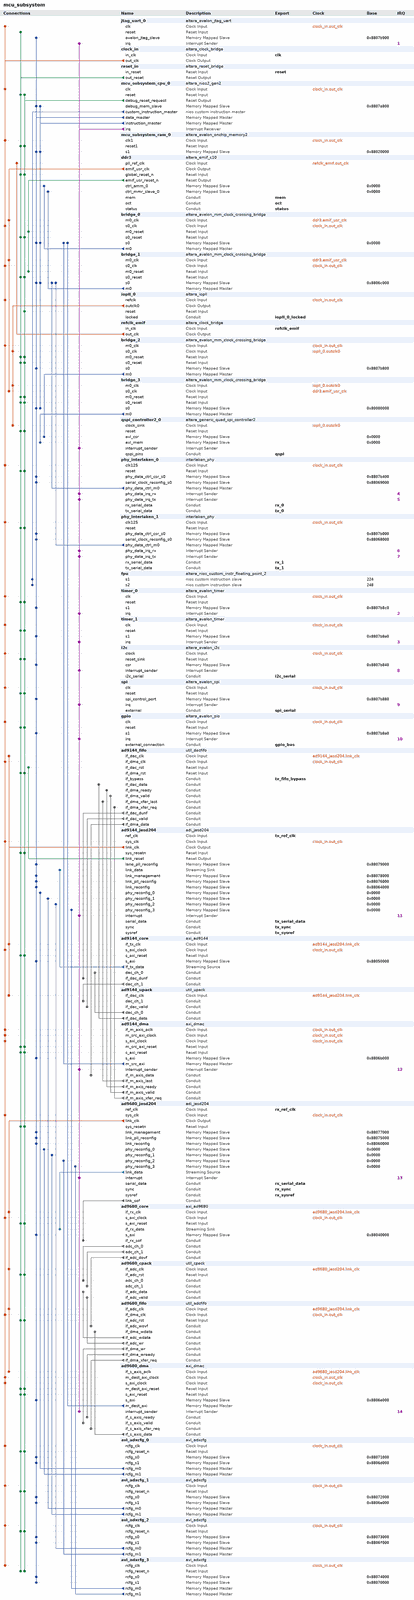
[diagram p0: system contents, whole]
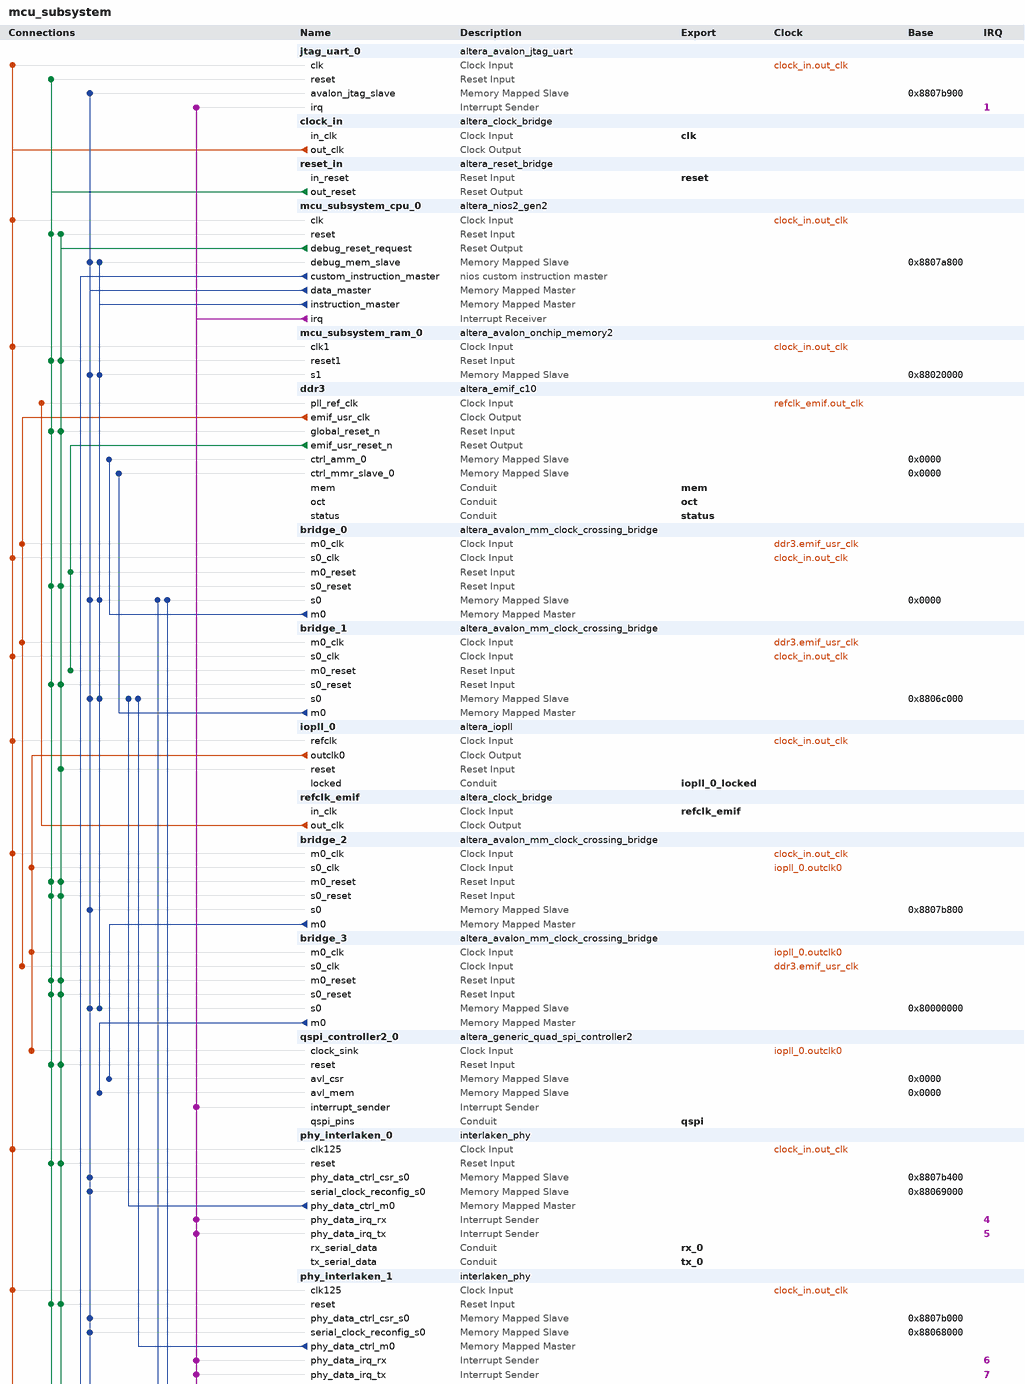
[diagram p1: system contents, upper part]
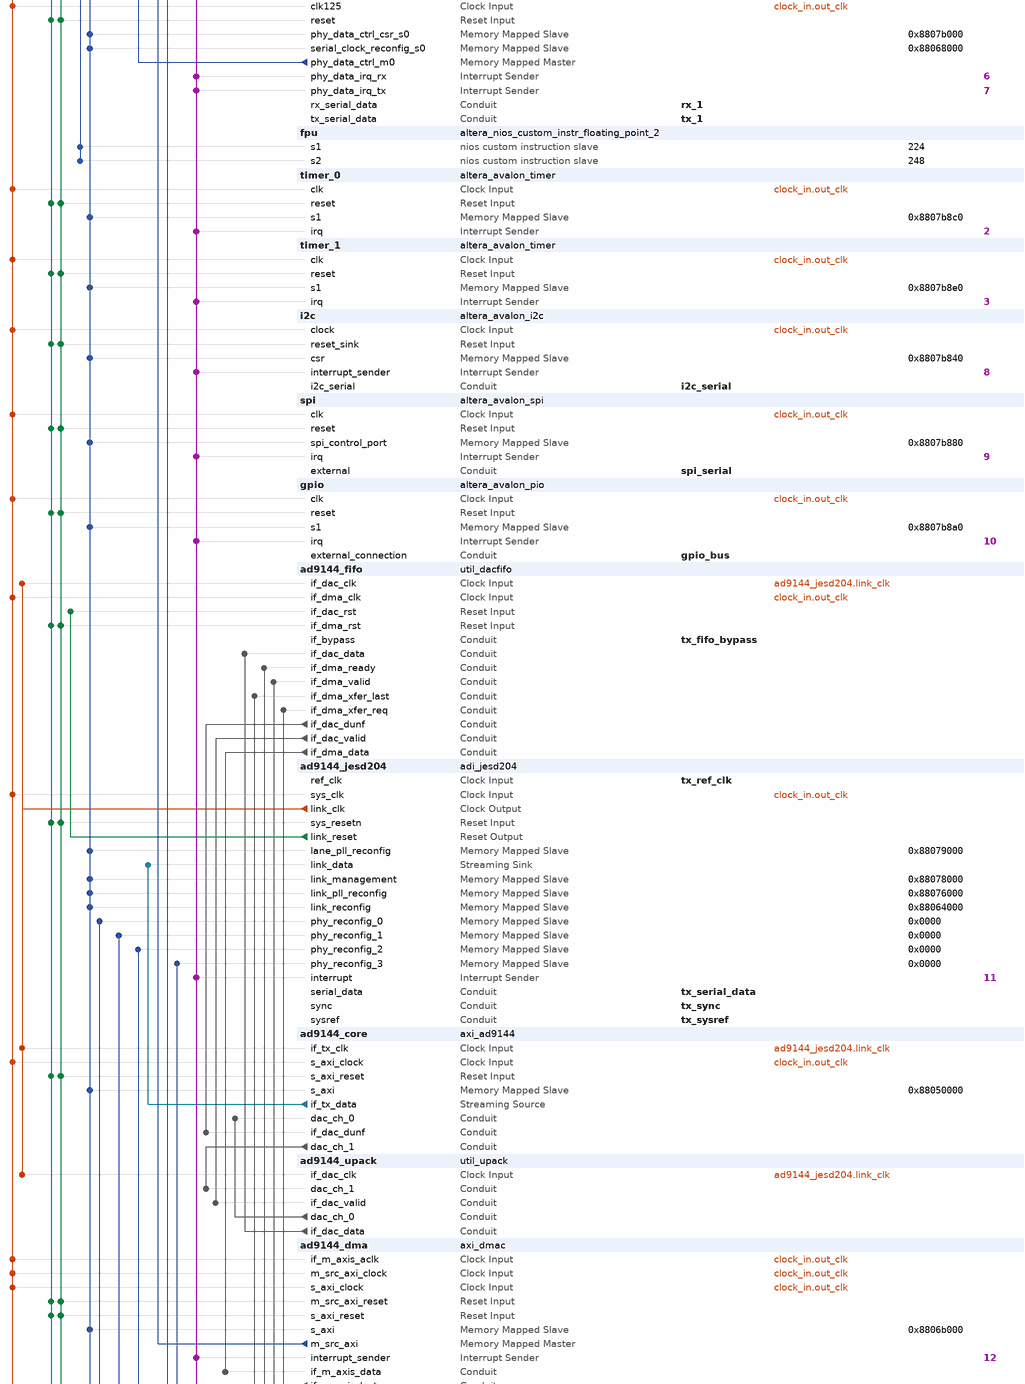
[diagram p2: system contents, middle part]
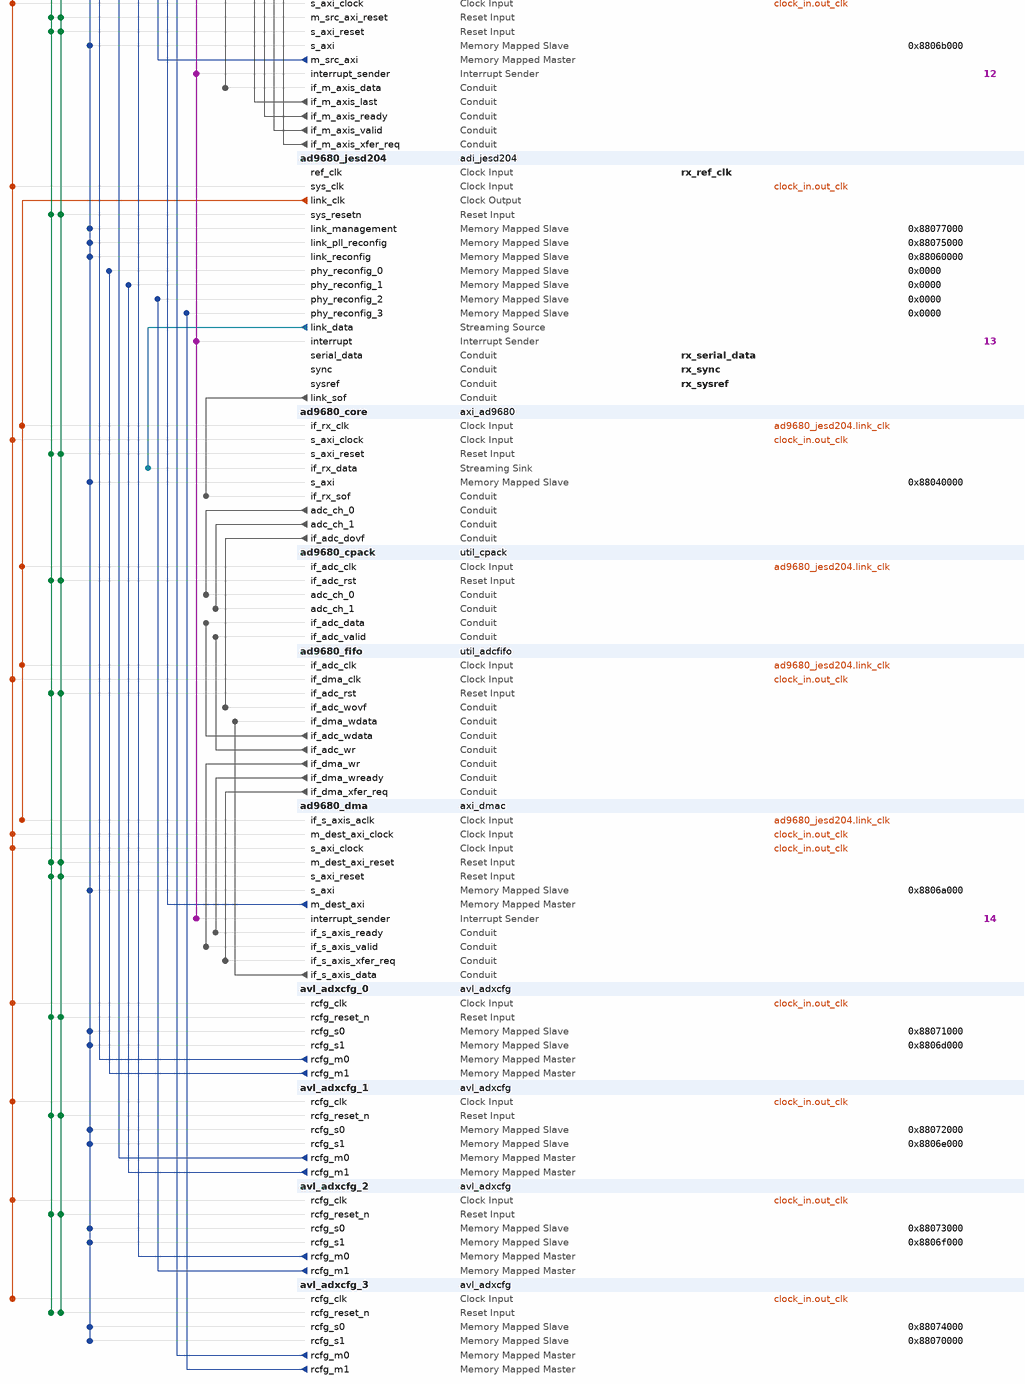
[diagram p3: system contents, lower part]
# Platform Designer (Qsys) system mcu_subsystem, Cyclone 10 GX 10CX220YF780I5G
# Parameters at their usual value, and those the tool derives, are not listed.
package require -exact qsys 1.0
create_system mcu_subsystem
set_project_property DEVICE_FAMILY {Cyclone 10 GX}
set_project_property DEVICE 10CX220YF780I5G

add_component jtag_uart_0 ip/mcu_subsystem/mcu_subsystem_jtag_uart_0.ip altera_avalon_jtag_uart jtag_uart_0 18.1

add_component clock_in ip/mcu_subsystem/mcu_subsystem_clock_in.ip altera_clock_bridge clock_in 18.1
load_component clock_in
set_component_parameter_value DERIVED_CLOCK_RATE 0
set_component_parameter_value EXPLICIT_CLOCK_RATE 125000000
save_component

add_component reset_in ip/mcu_subsystem/mcu_subsystem_reset_in.ip altera_reset_bridge reset_in 18.1
load_component reset_in
set_component_parameter_value ACTIVE_LOW_RESET 1
set_component_parameter_value SYNCHRONOUS_EDGES none
set_component_parameter_value SYNC_RESET 0
save_component

add_component mcu_subsystem_cpu_0 ip/mcu_subsystem/mcu_subsystem_cpu_0.ip altera_nios2_gen2 mcu_subsystem_cpu_0 18.1
load_component mcu_subsystem_cpu_0
set_component_parameter_value setting_support31bitdcachebypass false
set_component_parameter_value resetSlave ddr3.ctrl_amm_0
set_component_parameter_value exceptionSlave ddr3.ctrl_amm_0
set_component_parameter_value mul_shift_choice 1
set_component_parameter_value mul_64_impl 1
set_component_parameter_value dividerType srt2
set_component_parameter_value impl Fast
set_component_parameter_value icache_size 4096
set_component_parameter_value dcache_size 2048
save_component

add_component mcu_subsystem_ram_0 ip/mcu_subsystem/mcu_subsystem_ram_0.ip altera_avalon_onchip_memory2 mcu_subsystem_ram_0 18.1
load_component mcu_subsystem_ram_0
set_component_parameter_value dataWidth 32
set_component_parameter_value dualPort false
set_component_parameter_value initMemContent true
set_component_parameter_value initializationFileName onchip_mem.hex
set_component_parameter_value memorySize 131072
save_component

add_component ddr3 ip/mcu_subsystem/ddr3.ip altera_emif_c10 ddr3 18.1

add_component bridge_0 ip/mcu_subsystem/mcu_subsystem_mm_clock_crossing_bridge_0.ip altera_avalon_mm_clock_crossing_bridge bridge_0 18.1
load_component bridge_0
set_component_parameter_value DATA_WIDTH 32
set_component_parameter_value ADDRESS_WIDTH 30
set_component_parameter_value USE_AUTO_ADDRESS_WIDTH 1
set_component_parameter_value MAX_BURST_SIZE 128
set_component_parameter_value COMMAND_FIFO_DEPTH 64
set_component_parameter_value RESPONSE_FIFO_DEPTH 512
set_component_parameter_value MASTER_SYNC_DEPTH 2
set_component_parameter_value SLAVE_SYNC_DEPTH 2
set_component_parameter_value SYNC_RESET 0
save_component

add_component bridge_1 ip/mcu_subsystem/mcu_subsystem_mm_clock_crossing_bridge_1.ip altera_avalon_mm_clock_crossing_bridge bridge_1 18.1

add_component iopll_0 ip/mcu_subsystem/iopll_0.ip altera_iopll iopll_0 18.1
load_component iopll_0
set_component_parameter_value gui_device_family {Cyclone 10 GX}
set_component_parameter_value gui_device_component 10CX220YF780I5G
set_component_parameter_value gui_device_speed_grade 5
set_component_parameter_value gui_debug_mode false
set_component_parameter_value gui_skip_sdc_generation false
set_component_parameter_value gui_include_iossm false
set_component_parameter_value gui_cal_code_hex_file iossm.hex
set_component_parameter_value gui_parameter_table_hex_file seq_params_sim.hex
set_component_parameter_value gui_pll_tclk_mux_en false
set_component_parameter_value gui_pll_tclk_sel pll_tclk_m_src
set_component_parameter_value gui_pll_vco_freq_band_0 pll_freq_clk0_disabled
set_component_parameter_value gui_pll_vco_freq_band_1 pll_freq_clk1_disabled
set_component_parameter_value gui_pll_freqcal_en true
set_component_parameter_value gui_pll_freqcal_req_flag true
set_component_parameter_value gui_cal_converge false
set_component_parameter_value gui_cal_error cal_clean
set_component_parameter_value gui_pll_cal_done false
set_component_parameter_value gui_pll_type S10_Simple
set_component_parameter_value gui_pll_m_cnt_in_src c_m_cnt_in_src_ph_mux_clk
set_component_parameter_value gui_c_cnt_in_src0 c_m_cnt_in_src_ph_mux_clk
set_component_parameter_value gui_c_cnt_in_src1 c_m_cnt_in_src_ph_mux_clk
set_component_parameter_value gui_c_cnt_in_src2 c_m_cnt_in_src_ph_mux_clk
set_component_parameter_value system_info_device_family {Cyclone 10 GX}
set_component_parameter_value system_info_device_component 10CX220YF780I5G
set_component_parameter_value system_info_device_speed_grade 5
set_component_parameter_value system_part_trait_speed_grade 5
set_component_parameter_value gui_usr_device_speed_grade 1
set_component_parameter_value gui_location_type Full-Feature
set_component_parameter_value gui_use_logical false
set_component_parameter_value gui_reference_clock_frequency 125.0
set_component_parameter_value gui_reference_clock_frequency_ps 8000.0
set_component_parameter_value gui_use_coreclk false
set_component_parameter_value gui_refclk_might_change false
set_component_parameter_value gui_prot_mode UNUSED
set_component_parameter_value gui_use_locked true
set_component_parameter_value gui_pll_bandwidth_preset High
set_component_parameter_value gui_lock_setting {Low Lock Time}
set_component_parameter_value gui_pll_auto_reset true
set_component_parameter_value gui_en_lvds_ports Disabled
set_component_parameter_value gui_operation_mode direct
set_component_parameter_value gui_clock_to_compensate 0
set_component_parameter_value gui_use_NDFB_modes false
set_component_parameter_value gui_number_of_clocks 3
set_component_parameter_value gui_fixed_vco_frequency_ps 1667.0
set_component_parameter_value gui_vco_frequency 600.0
set_component_parameter_value gui_mif_gen_options {Generate New MIF File}
set_component_parameter_value gui_new_mif_file_path {~/pll.mif}
set_component_parameter_value gui_existing_mif_file_path {~/pll.mif}
set_component_parameter_value gui_mif_config_name unnamed
set_component_parameter_value gui_enable_permit_cal false
set_component_parameter_value gui_clock_name_global false
set_component_parameter_value gui_output_clock_frequency0 40.0
set_component_parameter_value gui_output_clock_frequency1 100.0
set_component_parameter_value gui_output_clock_frequency2 400.0
set_component_parameter_value gui_output_clock_frequency_ps0 25000.0
set_component_parameter_value gui_output_clock_frequency_ps1 10000.0
set_component_parameter_value gui_output_clock_frequency_ps2 2500.0
set_component_parameter_value gui_actual_output_clock_frequency0 40.0
set_component_parameter_value gui_actual_output_clock_frequency1 100.0
set_component_parameter_value gui_actual_output_clock_frequency2 400.0
set_component_parameter_value gui_actual_output_clock_frequency_range0 39.981618,39.983165,39.986559,40.0,40.019763,40.021930
set_component_parameter_value gui_actual_output_clock_frequency_range1 90.909091,92.307692,93.333333,100.0,107.692308,109.090909
set_component_parameter_value gui_actual_output_clock_frequency_range2 300.0,333.333333,350.0,400.0,466.666667,500.0
set_component_parameter_value gui_actual_phase_shift0 0.0
set_component_parameter_value gui_actual_phase_shift1 0.0
set_component_parameter_value gui_actual_phase_shift2 0.0
set_component_parameter_value gui_actual_phase_shift_range0 0.0,104.2,156.3,208.3,312.5,416.7
set_component_parameter_value gui_actual_phase_shift_range1 0.0,104.2,156.3,208.3,312.5,416.7
set_component_parameter_value gui_actual_phase_shift_range2 0.0,104.2,156.3,208.3,312.5,416.7
set_component_parameter_value gui_actual_phase_shift_deg0 0.0
set_component_parameter_value gui_actual_phase_shift_deg1 0.0
set_component_parameter_value gui_actual_phase_shift_deg2 0.0
set_component_parameter_value gui_actual_phase_shift_deg_range0 0.0,1.5,2.3,3.0,4.5,6.0
set_component_parameter_value gui_actual_phase_shift_deg_range1 0.0,3.8,5.6,7.5,11.3,15.0
set_component_parameter_value gui_actual_phase_shift_deg_range2 0.0,15.0,22.5,30.0,45.0,60.0
set_component_parameter_value gui_actual_duty_cycle0 50.0
set_component_parameter_value gui_actual_duty_cycle1 50.0
set_component_parameter_value gui_actual_duty_cycle2 50.0
set_component_parameter_value gui_actual_duty_cycle_range0 46.67,47.5,48.33,50.0,51.67,52.5
set_component_parameter_value gui_actual_duty_cycle_range1 41.67,43.75,45.83,50.0,54.17,56.25
set_component_parameter_value gui_actual_duty_cycle_range2 16.67,25.0,33.33,50.0,66.67
set_component_parameter_value parameterTable_names {M-Counter Divide Setting,N-Counter Divide Setting,VCO Frequency,C-Counter-0 Divide Setting,C-Counter-1 Divide Setting,C-Counter-2 Divide Setting,C-Counter-3 Divide Setting,C-Counter-4 Divide Setting,C-Counter-5 Divide Setting,C-Counter-6 Divide Setting,C-Counter-7 Divide Setting,C-Counter-8 Divide Setting,PLL Auto Reset,M-Counter Hi Divide,M-Counter Lo Divide,M-Counter Even Duty Enable,M-Counter Bypass Enable,N-Counter Hi Divide,N-Counter Lo Divide,N-Counter Even Duty Enable,N-Counter Bypass Enable,C-Counter-0 Hi Divide,C-Counter-1 Hi Divide,C-Counter-2 Hi Divide,C-Counter-3 Hi Divide,C-Counter-4 Hi Divide,C-Counter-5 Hi Divide,C-Counter-6 Hi Divide,C-Counter-7 Hi Divide,C-Counter-8 Hi Divide,C-Counter-0 Lo Divide,C-Counter-1 Lo Divide,C-Counter-2 Lo Divide,C-Counter-3 Lo Divide,C-Counter-4 Lo Divide,C-Counter-5 Lo Divide,C-Counter-6 Lo Divide,C-Counter-7 Lo Divide,C-Counter-8 Lo Divide,C-Counter-0 Even Duty Enable,C-Counter-1 Even Duty Enable,C-Counter-2 Even Duty Enable,C-Counter-3 Even Duty Enable,C-Counter-4 Even Duty Enable,C-Counter-5 Even Duty Enable,C-Counter-6 Even Duty Enable,C-Counter-7 Even Duty Enable,C-Counter-8 Even Duty Enable,C-Counter-0 Bypass Enable,C-Counter-1 Bypass Enable,C-Counter-2 Bypass Enable,C-Counter-3 Bypass Enable,C-Counter-4 Bypass Enable,C-Counter-5 Bypass Enable,C-Counter-6 Bypass Enable,C-Counter-7 Bypass Enable,C-Counter-8 Bypass Enable,C-Counter-0 Preset,C-Counter-1 Preset,C-Counter-2 Preset,C-Counter-3 Preset,C-Counter-4 Preset,C-Counter-5 Preset,C-Counter-6 Preset,C-Counter-7 Preset,C-Counter-8 Preset,C-Counter-0 Phase Mux Preset,C-Counter-1 Phase Mux Preset,C-Counter-2 Phase Mux Preset,C-Counter-3 Phase Mux Preset,C-Counter-4 Phase Mux Preset,C-Counter-5 Phase Mux Preset,C-Counter-6 Phase Mux Preset,C-Counter-7 Phase Mux Preset,C-Counter-8 Phase Mux Preset,Charge Pump Current,Bandwidth Control}
set_component_parameter_value parameterTable_values {32,5,800.0 MHz,20,8,2,1,1,1,1,1,1,true,16,16,false,false,3,2,true,false,10,4,1,256,256,256,256,256,256,10,4,1,256,256,256,256,256,256,false,false,false,false,false,false,false,false,false,false,false,false,true,true,true,true,true,true,1,1,1,1,1,1,1,1,1,0,0,0,0,0,0,0,0,0,pll_cp_setting28,pll_bw_res_setting4}
set_component_parameter_value mifTable_names {The MIF file specified does not yet exist}
set_component_parameter_value pll_m_cnt_basic 1
set_component_parameter_value pll_m_cnt 1
set_component_parameter_value prot_mode BASIC
set_component_parameter_value m_cnt_hi_div 16
set_component_parameter_value eff_m_cnt 1
set_component_parameter_value multiply_factor 32
set_component_parameter_value use_core_refclk false
set_component_parameter_value m_cnt_lo_div 16
set_component_parameter_value n_cnt_hi_div 3
set_component_parameter_value n_cnt_lo_div 2
set_component_parameter_value m_cnt_bypass_en false
set_component_parameter_value n_cnt_bypass_en false
set_component_parameter_value m_cnt_odd_div_duty_en false
set_component_parameter_value n_cnt_odd_div_duty_en true
set_component_parameter_value pll_vco_div 1
set_component_parameter_value pll_cp_current pll_cp_setting28
set_component_parameter_value pll_bwctrl pll_bw_res_setting4
set_component_parameter_value pll_fractional_division 1
set_component_parameter_value fractional_vco_multiplier false
set_component_parameter_value reference_clock_frequency {125.0 MHz}
set_component_parameter_value pll_fractional_cout 1
set_component_parameter_value pll_dsm_out_sel 1st_order
set_component_parameter_value operation_mode direct
set_component_parameter_value number_of_clocks 3
set_component_parameter_value number_of_outclks 3
set_component_parameter_value pll_vcoph_div 1
set_component_parameter_value pll_type {Cyclone 10 GX}
set_component_parameter_value pll_subtype General
set_component_parameter_value pll_output_clk_frequency {800.0 MHz}
set_component_parameter_value pll_pfd_frequency {25.0 MHz}
set_component_parameter_value mimic_fbclk_type gclk
set_component_parameter_value pll_bw_sel High
set_component_parameter_value pll_slf_rst true
set_component_parameter_value pll_fbclk_mux_1 pll_fbclk_mux_1_glb
set_component_parameter_value pll_fbclk_mux_2 pll_fbclk_mux_2_m_cnt
set_component_parameter_value pll_m_cnt_in_src c_m_cnt_in_src_ph_mux_clk
set_component_parameter_value pll_clkin_0_src clk_0
set_component_parameter_value refclk1_frequency {100.0 MHz}
set_component_parameter_value pll_clk_loss_sw_en false
set_component_parameter_value pll_manu_clk_sw_en false
set_component_parameter_value pll_auto_clk_sw_en false
set_component_parameter_value pll_clkin_1_src clk_0
set_component_parameter_value pll_clk_sw_dly 0
set_component_parameter_value pll_extclk_0_cnt_src pll_extclk_cnt_src_vss
set_component_parameter_value pll_extclk_1_cnt_src pll_extclk_cnt_src_vss
set_component_parameter_value pll_lock_fltr_cfg 100
set_component_parameter_value pll_unlock_fltr_cfg 2
set_component_parameter_value lock_mode low_lock_time
set_component_parameter_value clock_to_compensate 0
set_component_parameter_value clock_name_global false
set_component_parameter_value pll_freqcal_en true
set_component_parameter_value pll_defer_cal_user_mode true
set_component_parameter_value dprio_interface_sel 3
set_component_parameter_value merging_permitted false
set_component_parameter_value c_cnt_hi_div0 10
set_component_parameter_value c_cnt_hi_div1 4
set_component_parameter_value c_cnt_hi_div2 1
set_component_parameter_value c_cnt_hi_div3 256
set_component_parameter_value c_cnt_hi_div4 256
set_component_parameter_value c_cnt_hi_div5 256
set_component_parameter_value c_cnt_hi_div6 256
set_component_parameter_value c_cnt_hi_div7 256
set_component_parameter_value c_cnt_hi_div8 256
set_component_parameter_value c_cnt_hi_div9 1
set_component_parameter_value c_cnt_hi_div10 1
set_component_parameter_value c_cnt_hi_div11 1
set_component_parameter_value c_cnt_hi_div12 1
set_component_parameter_value c_cnt_hi_div13 1
set_component_parameter_value c_cnt_hi_div14 1
set_component_parameter_value c_cnt_hi_div15 1
set_component_parameter_value c_cnt_hi_div16 1
set_component_parameter_value c_cnt_hi_div17 1
set_component_parameter_value c_cnt_lo_div0 10
set_component_parameter_value c_cnt_lo_div1 4
set_component_parameter_value c_cnt_lo_div2 1
set_component_parameter_value c_cnt_lo_div3 256
set_component_parameter_value c_cnt_lo_div4 256
set_component_parameter_value c_cnt_lo_div5 256
set_component_parameter_value c_cnt_lo_div6 256
set_component_parameter_value c_cnt_lo_div7 256
set_component_parameter_value c_cnt_lo_div8 256
set_component_parameter_value c_cnt_lo_div9 1
set_component_parameter_value c_cnt_lo_div10 1
set_component_parameter_value c_cnt_lo_div11 1
set_component_parameter_value c_cnt_lo_div12 1
set_component_parameter_value c_cnt_lo_div13 1
set_component_parameter_value c_cnt_lo_div14 1
set_component_parameter_value c_cnt_lo_div15 1
set_component_parameter_value c_cnt_lo_div16 1
set_component_parameter_value c_cnt_lo_div17 1
set_component_parameter_value c_cnt_prst0 1
set_component_parameter_value c_cnt_prst1 1
set_component_parameter_value c_cnt_prst2 1
set_component_parameter_value c_cnt_prst3 1
set_component_parameter_value c_cnt_prst4 1
set_component_parameter_value c_cnt_prst5 1
set_component_parameter_value c_cnt_prst6 1
set_component_parameter_value c_cnt_prst7 1
set_component_parameter_value c_cnt_prst8 1
set_component_parameter_value c_cnt_prst9 1
set_component_parameter_value c_cnt_prst10 1
set_component_parameter_value c_cnt_prst11 1
set_component_parameter_value c_cnt_prst12 1
set_component_parameter_value c_cnt_prst13 1
set_component_parameter_value c_cnt_prst14 1
set_component_parameter_value c_cnt_prst15 1
set_component_parameter_value c_cnt_prst16 1
set_component_parameter_value c_cnt_prst17 1
set_component_parameter_value c_cnt_ph_mux_prst0 0
set_component_parameter_value c_cnt_ph_mux_prst1 0
set_component_parameter_value c_cnt_ph_mux_prst2 0
set_component_parameter_value c_cnt_ph_mux_prst3 0
set_component_parameter_value c_cnt_ph_mux_prst4 0
set_component_parameter_value c_cnt_ph_mux_prst5 0
set_component_parameter_value c_cnt_ph_mux_prst6 0
set_component_parameter_value c_cnt_ph_mux_prst7 0
set_component_parameter_value c_cnt_ph_mux_prst8 0
set_component_parameter_value c_cnt_ph_mux_prst9 0
set_component_parameter_value c_cnt_ph_mux_prst10 0
set_component_parameter_value c_cnt_ph_mux_prst11 0
set_component_parameter_value c_cnt_ph_mux_prst12 0
set_component_parameter_value c_cnt_ph_mux_prst13 0
set_component_parameter_value c_cnt_ph_mux_prst14 0
set_component_parameter_value c_cnt_ph_mux_prst15 0
set_component_parameter_value c_cnt_ph_mux_prst16 0
set_component_parameter_value c_cnt_ph_mux_prst17 0
set_component_parameter_value c_cnt_in_src0 c_m_cnt_in_src_ph_mux_clk
set_component_parameter_value c_cnt_in_src1 c_m_cnt_in_src_ph_mux_clk
set_component_parameter_value c_cnt_in_src2 c_m_cnt_in_src_ph_mux_clk
set_component_parameter_value c_cnt_in_src3 c_m_cnt_in_src_ph_mux_clk
set_component_parameter_value c_cnt_in_src4 c_m_cnt_in_src_ph_mux_clk
set_component_parameter_value c_cnt_in_src5 c_m_cnt_in_src_ph_mux_clk
set_component_parameter_value c_cnt_in_src6 c_m_cnt_in_src_ph_mux_clk
set_component_parameter_value c_cnt_in_src7 c_m_cnt_in_src_ph_mux_clk
set_component_parameter_value c_cnt_in_src8 c_m_cnt_in_src_ph_mux_clk
set_component_parameter_value c_cnt_in_src9 c_m_cnt_in_src_ph_mux_clk
set_component_parameter_value c_cnt_in_src10 c_m_cnt_in_src_ph_mux_clk
set_component_parameter_value c_cnt_in_src11 c_m_cnt_in_src_ph_mux_clk
set_component_parameter_value c_cnt_in_src12 c_m_cnt_in_src_ph_mux_clk
set_component_parameter_value c_cnt_in_src13 c_m_cnt_in_src_ph_mux_clk
set_component_parameter_value c_cnt_in_src14 c_m_cnt_in_src_ph_mux_clk
set_component_parameter_value c_cnt_in_src15 c_m_cnt_in_src_ph_mux_clk
set_component_parameter_value c_cnt_in_src16 c_m_cnt_in_src_ph_mux_clk
set_component_parameter_value c_cnt_in_src17 c_m_cnt_in_src_ph_mux_clk
set_component_parameter_value c_cnt_bypass_en0 false
set_component_parameter_value c_cnt_bypass_en1 false
set_component_parameter_value c_cnt_bypass_en2 false
set_component_parameter_value c_cnt_bypass_en3 true
set_component_parameter_value c_cnt_bypass_en4 true
set_component_parameter_value c_cnt_bypass_en5 true
set_component_parameter_value c_cnt_bypass_en6 true
set_component_parameter_value c_cnt_bypass_en7 true
set_component_parameter_value c_cnt_bypass_en8 true
set_component_parameter_value c_cnt_bypass_en9 true
set_component_parameter_value c_cnt_bypass_en10 true
set_component_parameter_value c_cnt_bypass_en11 true
set_component_parameter_value c_cnt_bypass_en12 true
set_component_parameter_value c_cnt_bypass_en13 true
set_component_parameter_value c_cnt_bypass_en14 true
set_component_parameter_value c_cnt_bypass_en15 true
set_component_parameter_value c_cnt_bypass_en16 true
set_component_parameter_value c_cnt_bypass_en17 true
set_component_parameter_value c_cnt_odd_div_duty_en0 false
set_component_parameter_value c_cnt_odd_div_duty_en1 false
set_component_parameter_value c_cnt_odd_div_duty_en2 false
set_component_parameter_value c_cnt_odd_div_duty_en3 false
set_component_parameter_value c_cnt_odd_div_duty_en4 false
set_component_parameter_value c_cnt_odd_div_duty_en5 false
set_component_parameter_value c_cnt_odd_div_duty_en6 false
set_component_parameter_value c_cnt_odd_div_duty_en7 false
set_component_parameter_value c_cnt_odd_div_duty_en8 false
set_component_parameter_value c_cnt_odd_div_duty_en9 false
set_component_parameter_value c_cnt_odd_div_duty_en10 false
set_component_parameter_value c_cnt_odd_div_duty_en11 false
set_component_parameter_value c_cnt_odd_div_duty_en12 false
set_component_parameter_value c_cnt_odd_div_duty_en13 false
set_component_parameter_value c_cnt_odd_div_duty_en14 false
set_component_parameter_value c_cnt_odd_div_duty_en15 false
set_component_parameter_value c_cnt_odd_div_duty_en16 false
set_component_parameter_value c_cnt_odd_div_duty_en17 false
set_component_parameter_value output_clock_frequency0 {40.0 MHz}
set_component_parameter_value output_clock_frequency1 {100.0 MHz}
set_component_parameter_value output_clock_frequency2 {400.0 MHz}
set_component_parameter_value output_clock_frequency3 {0 ps}
set_component_parameter_value output_clock_frequency4 {0 ps}
set_component_parameter_value output_clock_frequency5 {0 ps}
set_component_parameter_value output_clock_frequency6 {0 ps}
set_component_parameter_value output_clock_frequency7 {0 ps}
set_component_parameter_value output_clock_frequency8 {0 ps}
set_component_parameter_value output_clock_frequency9 {0 MHz}
set_component_parameter_value output_clock_frequency10 {0 MHz}
set_component_parameter_value output_clock_frequency11 {0 MHz}
set_component_parameter_value output_clock_frequency12 {0 MHz}
set_component_parameter_value output_clock_frequency13 {0 MHz}
set_component_parameter_value output_clock_frequency14 {0 MHz}
set_component_parameter_value output_clock_frequency15 {0 MHz}
set_component_parameter_value output_clock_frequency16 {0 MHz}
set_component_parameter_value output_clock_frequency17 {0 MHz}
set_component_parameter_value phase_shift0 {0 ps}
set_component_parameter_value phase_shift1 {0 ps}
set_component_parameter_value phase_shift2 {0 ps}
set_component_parameter_value phase_shift3 {0 ps}
set_component_parameter_value phase_shift4 {0 ps}
set_component_parameter_value phase_shift5 {0 ps}
set_component_parameter_value phase_shift6 {0 ps}
set_component_parameter_value phase_shift7 {0 ps}
set_component_parameter_value phase_shift8 {0 ps}
set_component_parameter_value phase_shift9 {0 ps}
set_component_parameter_value phase_shift10 {0 ps}
set_component_parameter_value phase_shift11 {0 ps}
set_component_parameter_value phase_shift12 {0 ps}
set_component_parameter_value phase_shift13 {0 ps}
set_component_parameter_value phase_shift14 {0 ps}
set_component_parameter_value phase_shift15 {0 ps}
set_component_parameter_value phase_shift16 {0 ps}
set_component_parameter_value phase_shift17 {0 ps}
set_component_parameter_value duty_cycle0 50
set_component_parameter_value duty_cycle1 50
set_component_parameter_value duty_cycle2 50
set_component_parameter_value duty_cycle3 50
set_component_parameter_value duty_cycle4 50
set_component_parameter_value duty_cycle5 50
set_component_parameter_value duty_cycle6 50
set_component_parameter_value duty_cycle7 50
set_component_parameter_value duty_cycle8 50
set_component_parameter_value duty_cycle9 50
set_component_parameter_value duty_cycle10 50
set_component_parameter_value duty_cycle11 50
set_component_parameter_value duty_cycle12 50
set_component_parameter_value duty_cycle13 50
set_component_parameter_value duty_cycle14 50
set_component_parameter_value duty_cycle15 50
set_component_parameter_value duty_cycle16 50
set_component_parameter_value duty_cycle17 50
set_component_parameter_value clock_name_0 outclk0
set_component_parameter_value clock_name_1 outclk1
set_component_parameter_value clock_name_2 outclk2
set_component_parameter_value clock_name_global_0 false
set_component_parameter_value clock_name_global_1 false
set_component_parameter_value clock_name_global_2 false
set_component_parameter_value clock_name_global_3 false
set_component_parameter_value clock_name_global_4 false
set_component_parameter_value clock_name_global_5 false
set_component_parameter_value clock_name_global_6 false
set_component_parameter_value clock_name_global_7 false
set_component_parameter_value clock_name_global_8 false
set_component_parameter_value divide_factor0 1
set_component_parameter_value divide_factor1 1
set_component_parameter_value divide_factor2 1
set_component_parameter_value divide_factor3 1
set_component_parameter_value divide_factor4 1
set_component_parameter_value divide_factor5 1
set_component_parameter_value divide_factor6 1
set_component_parameter_value divide_factor7 1
set_component_parameter_value divide_factor8 1
set_component_parameter_value pll_tclk_mux_en false
set_component_parameter_value pll_tclk_sel pll_tclk_m_src
set_component_parameter_value pll_vco_freq_band_0 pll_freq_clk0_disabled
set_component_parameter_value pll_vco_freq_band_1 pll_freq_clk1_disabled
set_component_parameter_value pll_freqcal_req_flag true
set_component_parameter_value cal_converge false
set_component_parameter_value cal_error cal_clean
set_component_parameter_value pll_cal_done false
set_component_parameter_value include_iossm false
set_component_parameter_value cal_code_hex_file iossm.hex
set_component_parameter_value parameter_table_hex_file seq_params_sim.hex
set_component_parameter_value iossm_nios_sim_clk_period_ps 1333
set_component_parameter_value hp_number_of_family_allowable_clocks 9
set_component_parameter_value hp_previous_num_clocks 1
set_component_parameter_value hp_actual_vco_frequency_fp 600.0
set_component_parameter_value hp_qsys_scripting_mode false
set_component_parameter_value hp_actual_output_clock_frequency_fp0 40.0
set_component_parameter_value hp_actual_output_clock_frequency_fp1 100.0
set_component_parameter_value hp_actual_output_clock_frequency_fp2 400.0
set_component_parameter_value hp_actual_output_clock_frequency_fp3 100.0
set_component_parameter_value hp_actual_output_clock_frequency_fp4 100.0
set_component_parameter_value hp_actual_output_clock_frequency_fp5 100.0
set_component_parameter_value hp_actual_output_clock_frequency_fp6 100.0
set_component_parameter_value hp_actual_output_clock_frequency_fp7 100.0
set_component_parameter_value hp_actual_output_clock_frequency_fp8 100.0
set_component_parameter_value hp_actual_output_clock_frequency_fp9 100.0
set_component_parameter_value hp_actual_output_clock_frequency_fp10 100.0
set_component_parameter_value hp_actual_output_clock_frequency_fp11 100.0
set_component_parameter_value hp_actual_output_clock_frequency_fp12 100.0
set_component_parameter_value hp_actual_output_clock_frequency_fp13 100.0
set_component_parameter_value hp_actual_output_clock_frequency_fp14 100.0
set_component_parameter_value hp_actual_output_clock_frequency_fp15 100.0
set_component_parameter_value hp_actual_output_clock_frequency_fp16 100.0
set_component_parameter_value hp_actual_output_clock_frequency_fp17 100.0
set_component_parameter_value hp_actual_phase_shift_fp0 0.0
set_component_parameter_value hp_actual_phase_shift_fp1 0.0
set_component_parameter_value hp_actual_phase_shift_fp2 0.0
set_component_parameter_value hp_actual_phase_shift_fp3 0.0
set_component_parameter_value hp_actual_phase_shift_fp4 0.0
set_component_parameter_value hp_actual_phase_shift_fp5 0.0
set_component_parameter_value hp_actual_phase_shift_fp6 0.0
set_component_parameter_value hp_actual_phase_shift_fp7 0.0
set_component_parameter_value hp_actual_phase_shift_fp8 0.0
set_component_parameter_value hp_actual_phase_shift_fp9 0.0
set_component_parameter_value hp_actual_phase_shift_fp10 0.0
set_component_parameter_value hp_actual_phase_shift_fp11 0.0
set_component_parameter_value hp_actual_phase_shift_fp12 0.0
set_component_parameter_value hp_actual_phase_shift_fp13 0.0
set_component_parameter_value hp_actual_phase_shift_fp14 0.0
set_component_parameter_value hp_actual_phase_shift_fp15 0.0
set_component_parameter_value hp_actual_phase_shift_fp16 0.0
set_component_parameter_value hp_actual_phase_shift_fp17 0.0
set_component_parameter_value hp_actual_duty_cycle_fp0 50.0
set_component_parameter_value hp_actual_duty_cycle_fp1 50.0
set_component_parameter_value hp_actual_duty_cycle_fp2 50.0
set_component_parameter_value hp_actual_duty_cycle_fp3 50.0
set_component_parameter_value hp_actual_duty_cycle_fp4 50.0
set_component_parameter_value hp_actual_duty_cycle_fp5 50.0
set_component_parameter_value hp_actual_duty_cycle_fp6 50.0
set_component_parameter_value hp_actual_duty_cycle_fp7 50.0
set_component_parameter_value hp_actual_duty_cycle_fp8 50.0
set_component_parameter_value hp_actual_duty_cycle_fp9 50.0
set_component_parameter_value hp_actual_duty_cycle_fp10 50.0
set_component_parameter_value hp_actual_duty_cycle_fp11 50.0
set_component_parameter_value hp_actual_duty_cycle_fp12 50.0
set_component_parameter_value hp_actual_duty_cycle_fp13 50.0
set_component_parameter_value hp_actual_duty_cycle_fp14 50.0
set_component_parameter_value hp_actual_duty_cycle_fp15 50.0
set_component_parameter_value hp_actual_duty_cycle_fp16 50.0
set_component_parameter_value hp_actual_duty_cycle_fp17 50.0
save_component

add_component refclk_emif ip/mcu_subsystem/mcu_subsystem_clock_bridge_1.ip altera_clock_bridge refclk_emif 18.1

add_component bridge_2 ip/mcu_subsystem/mcu_subsystem_mm_clock_crossing_bridge_2.ip altera_avalon_mm_clock_crossing_bridge bridge_2 18.1

add_component bridge_3 ip/mcu_subsystem/mcu_subsystem_mm_clock_crossing_bridge_3.ip altera_avalon_mm_clock_crossing_bridge bridge_3 18.1

add_component qspi_controller2_0 ip/mcu_subsystem/mcu_subsystem_generic_quad_spi_controller2_0.ip altera_generic_quad_spi_controller2 qspi_controller2_0 18.1
load_component qspi_controller2_0
set_component_parameter_value clkFreq 40000000
set_component_parameter_value CS_WIDTH 3
set_component_parameter_value ADDR_WIDTH 25
set_component_parameter_value ASI_WIDTH 4
set_component_parameter_value ASMI_ADDR_WIDTH 32
set_component_parameter_value ENABLE_4BYTE_ADDR 1
set_component_parameter_value DDASI 1
set_component_parameter_value gui_use_gpio true
set_component_parameter_value FLASH_TYPE MT25QU01G
set_component_parameter_value IO_MODE QUAD
set_component_parameter_value CHIP_SELS 1
save_component

add_component phy_interlaken_0 interlaken_phy.qsys interlaken_phy phy_interlaken_0 

add_component phy_interlaken_1 interlaken_phy.qsys interlaken_phy phy_interlaken_1 

add_component fpu ip/mcu_subsystem/mcu_subsystem_nios_custom_instr_floating_point_2_0.ip altera_nios_custom_instr_floating_point_2 fpu 18.1
load_component fpu
set_component_parameter_value arithmetic_present true
set_component_parameter_value root_present true
set_component_parameter_value conversion_present true
set_component_parameter_value comparison_present true
save_component

add_component timer_0 ip/mcu_subsystem/timer_0.ip altera_avalon_timer timer_0 18.1
load_component timer_0
set_component_parameter_value period 1
set_component_parameter_value periodUnits MSEC
set_component_parameter_value timerPreset FULL_FEATURED
save_component

add_component timer_1 ip/mcu_subsystem/timer_1.ip altera_avalon_timer timer_1 18.1

add_component i2c ip/mcu_subsystem/i2c.ip altera_avalon_i2c i2c 18.1
load_component i2c
set_component_parameter_value FIFO_DEPTH 4
save_component

add_component spi ip/mcu_subsystem/spi.ip altera_avalon_spi spi 18.1

add_component gpio ip/mcu_subsystem/gpio.ip altera_avalon_pio gpio 18.1

add_component ad9144_fifo ip/mcu_subsystem/ad9144_fifo.ip util_dacfifo ad9144_fifo 1.0
load_component ad9144_fifo
set_component_parameter_value ADDRESS_WIDTH 10
set_component_parameter_value DATA_WIDTH 128
save_component

add_component ad9144_jesd204 ip/mcu_subsystem/ad9144_jesd204.ip adi_jesd204 ad9144_jesd204 1.0
load_component ad9144_jesd204
set_component_parameter_value DEVICE 10CX220YF780I5G
set_component_parameter_value TX_OR_RX_N true
set_component_parameter_value ID 0
set_component_parameter_value LANE_RATE 10000.0
set_component_parameter_value SYSCLK_FREQUENCY 125.0
set_component_parameter_value REFCLK_FREQUENCY 125.0
set_component_parameter_value NUM_OF_LANES 4
set_component_parameter_value LANE_MAP {0 3 1 2}
set_component_parameter_value LANE_INVERT 0
set_component_parameter_value SOFT_PCS true
save_component

add_component ad9144_core ip/mcu_subsystem/ad9144_core.ip axi_ad9144 ad9144_core 1.0
load_component ad9144_core
set_component_parameter_value ID 0
set_component_parameter_value QUAD_OR_DUAL_N 0
save_component

add_component ad9144_upack ip/mcu_subsystem/ad9144_upack.ip util_upack ad9144_upack 1.0
load_component ad9144_upack
set_component_parameter_value CHANNEL_DATA_WIDTH 64
set_component_parameter_value NUM_OF_CHANNELS 2
save_component

add_component ad9144_dma ip/mcu_subsystem/ad9144_dma.ip axi_dmac ad9144_dma 1.0

add_component ad9680_jesd204 ip/mcu_subsystem/ad9680_jesd204.ip adi_jesd204 ad9680_jesd204 1.0
load_component ad9680_jesd204
set_component_parameter_value DEVICE 10CX220YF780I5G
set_component_parameter_value TX_OR_RX_N false
set_component_parameter_value ID 1
set_component_parameter_value LANE_RATE 10000.0
set_component_parameter_value SYSCLK_FREQUENCY 125.0
set_component_parameter_value REFCLK_FREQUENCY 125.0
set_component_parameter_value NUM_OF_LANES 4
set_component_parameter_value LANE_INVERT 0
set_component_parameter_value SOFT_PCS true
save_component

add_component ad9680_core ip/mcu_subsystem/ad9680_core.ip axi_ad9680 ad9680_core 1.0
load_component ad9680_core
set_component_parameter_value ID 0
save_component

add_component ad9680_cpack ip/mcu_subsystem/ad9680_cpack.ip util_cpack ad9680_cpack 1.0

add_component ad9680_fifo ip/mcu_subsystem/ad9680_fifo.ip util_adcfifo ad9680_fifo 1.0

add_component ad9680_dma ip/mcu_subsystem/ad9680_dma.ip axi_dmac ad9680_dma 1.0

add_component avl_adxcfg_0 ip/mcu_subsystem/avl_adxcfg_0.ip avl_adxcfg avl_adxcfg_0 1.0

add_component avl_adxcfg_1 ip/mcu_subsystem/avl_adxcfg_1.ip avl_adxcfg avl_adxcfg_1 1.0

add_component avl_adxcfg_2 ip/mcu_subsystem/avl_adxcfg_2.ip avl_adxcfg avl_adxcfg_2 1.0

add_component avl_adxcfg_3 ip/mcu_subsystem/avl_adxcfg_3.ip avl_adxcfg avl_adxcfg_3 1.0

# connections
add_connection ad9144_jesd204.link_clk ad9144_core.if_tx_clk clock
add_connection ad9144_jesd204.link_clk ad9144_fifo.if_dac_clk clock
add_connection ad9144_jesd204.link_clk ad9144_upack.if_dac_clk clock
add_connection ad9680_jesd204.link_clk ad9680_core.if_rx_clk clock
add_connection ad9680_jesd204.link_clk ad9680_cpack.if_adc_clk clock
add_connection ad9680_jesd204.link_clk ad9680_dma.if_s_axis_aclk clock
add_connection ad9680_jesd204.link_clk ad9680_fifo.if_adc_clk clock
add_connection clock_in.out_clk ad9144_core.s_axi_clock clock
add_connection clock_in.out_clk ad9144_dma.if_m_axis_aclk clock
add_connection clock_in.out_clk ad9144_dma.m_src_axi_clock clock
add_connection clock_in.out_clk ad9144_dma.s_axi_clock clock
add_connection clock_in.out_clk ad9144_fifo.if_dma_clk clock
add_connection clock_in.out_clk ad9144_jesd204.sys_clk clock
add_connection clock_in.out_clk ad9680_core.s_axi_clock clock
add_connection clock_in.out_clk ad9680_dma.m_dest_axi_clock clock
add_connection clock_in.out_clk ad9680_dma.s_axi_clock clock
add_connection clock_in.out_clk ad9680_fifo.if_dma_clk clock
add_connection clock_in.out_clk ad9680_jesd204.sys_clk clock
add_connection clock_in.out_clk avl_adxcfg_0.rcfg_clk clock
add_connection clock_in.out_clk avl_adxcfg_1.rcfg_clk clock
add_connection clock_in.out_clk avl_adxcfg_2.rcfg_clk clock
add_connection clock_in.out_clk avl_adxcfg_3.rcfg_clk clock
add_connection clock_in.out_clk bridge_0.s0_clk clock
add_connection clock_in.out_clk bridge_1.s0_clk clock
add_connection clock_in.out_clk bridge_2.m0_clk clock
add_connection clock_in.out_clk gpio.clk clock
add_connection clock_in.out_clk i2c.clock clock
add_connection clock_in.out_clk iopll_0.refclk clock
add_connection clock_in.out_clk jtag_uart_0.clk clock
add_connection clock_in.out_clk mcu_subsystem_cpu_0.clk clock
add_connection clock_in.out_clk mcu_subsystem_ram_0.clk1 clock
add_connection clock_in.out_clk phy_interlaken_0.clk125 clock
add_connection clock_in.out_clk phy_interlaken_1.clk125 clock
add_connection clock_in.out_clk spi.clk clock
add_connection clock_in.out_clk timer_0.clk clock
add_connection clock_in.out_clk timer_1.clk clock
add_connection ddr3.emif_usr_clk bridge_0.m0_clk clock
add_connection ddr3.emif_usr_clk bridge_1.m0_clk clock
add_connection ddr3.emif_usr_clk bridge_3.s0_clk clock
add_connection iopll_0.outclk0 bridge_2.s0_clk clock
add_connection iopll_0.outclk0 bridge_3.m0_clk clock
add_connection iopll_0.outclk0 qspi_controller2_0.clock_sink clock
add_connection refclk_emif.out_clk ddr3.pll_ref_clk clock
add_connection ad9144_jesd204.link_reset ad9144_fifo.if_dac_rst reset
add_connection ddr3.emif_usr_reset_n bridge_0.m0_reset reset
add_connection ddr3.emif_usr_reset_n bridge_1.m0_reset reset
add_connection mcu_subsystem_cpu_0.debug_reset_request ad9144_core.s_axi_reset reset
add_connection mcu_subsystem_cpu_0.debug_reset_request ad9144_dma.m_src_axi_reset reset
add_connection mcu_subsystem_cpu_0.debug_reset_request ad9144_dma.s_axi_reset reset
add_connection mcu_subsystem_cpu_0.debug_reset_request ad9144_fifo.if_dma_rst reset
add_connection mcu_subsystem_cpu_0.debug_reset_request ad9144_jesd204.sys_resetn reset
add_connection mcu_subsystem_cpu_0.debug_reset_request ad9680_core.s_axi_reset reset
add_connection mcu_subsystem_cpu_0.debug_reset_request ad9680_cpack.if_adc_rst reset
add_connection mcu_subsystem_cpu_0.debug_reset_request ad9680_dma.m_dest_axi_reset reset
add_connection mcu_subsystem_cpu_0.debug_reset_request ad9680_dma.s_axi_reset reset
add_connection mcu_subsystem_cpu_0.debug_reset_request ad9680_fifo.if_adc_rst reset
add_connection mcu_subsystem_cpu_0.debug_reset_request ad9680_jesd204.sys_resetn reset
add_connection mcu_subsystem_cpu_0.debug_reset_request avl_adxcfg_0.rcfg_reset_n reset
add_connection mcu_subsystem_cpu_0.debug_reset_request avl_adxcfg_1.rcfg_reset_n reset
add_connection mcu_subsystem_cpu_0.debug_reset_request avl_adxcfg_2.rcfg_reset_n reset
add_connection mcu_subsystem_cpu_0.debug_reset_request avl_adxcfg_3.rcfg_reset_n reset
add_connection mcu_subsystem_cpu_0.debug_reset_request bridge_0.s0_reset reset
add_connection mcu_subsystem_cpu_0.debug_reset_request bridge_1.s0_reset reset
add_connection mcu_subsystem_cpu_0.debug_reset_request bridge_2.m0_reset reset
add_connection mcu_subsystem_cpu_0.debug_reset_request bridge_2.s0_reset reset
add_connection mcu_subsystem_cpu_0.debug_reset_request bridge_3.m0_reset reset
add_connection mcu_subsystem_cpu_0.debug_reset_request bridge_3.s0_reset reset
add_connection mcu_subsystem_cpu_0.debug_reset_request ddr3.global_reset_n reset
add_connection mcu_subsystem_cpu_0.debug_reset_request gpio.reset reset
add_connection mcu_subsystem_cpu_0.debug_reset_request i2c.reset_sink reset
add_connection mcu_subsystem_cpu_0.debug_reset_request iopll_0.reset reset
add_connection mcu_subsystem_cpu_0.debug_reset_request mcu_subsystem_cpu_0.reset reset
add_connection mcu_subsystem_cpu_0.debug_reset_request mcu_subsystem_ram_0.reset1 reset
add_connection mcu_subsystem_cpu_0.debug_reset_request phy_interlaken_0.reset reset
add_connection mcu_subsystem_cpu_0.debug_reset_request phy_interlaken_1.reset reset
add_connection mcu_subsystem_cpu_0.debug_reset_request qspi_controller2_0.reset reset
add_connection mcu_subsystem_cpu_0.debug_reset_request spi.reset reset
add_connection mcu_subsystem_cpu_0.debug_reset_request timer_0.reset reset
add_connection mcu_subsystem_cpu_0.debug_reset_request timer_1.reset reset
add_connection reset_in.out_reset ad9144_core.s_axi_reset reset
add_connection reset_in.out_reset ad9144_dma.m_src_axi_reset reset
add_connection reset_in.out_reset ad9144_dma.s_axi_reset reset
add_connection reset_in.out_reset ad9144_fifo.if_dma_rst reset
add_connection reset_in.out_reset ad9144_jesd204.sys_resetn reset
add_connection reset_in.out_reset ad9680_core.s_axi_reset reset
add_connection reset_in.out_reset ad9680_cpack.if_adc_rst reset
add_connection reset_in.out_reset ad9680_dma.m_dest_axi_reset reset
add_connection reset_in.out_reset ad9680_dma.s_axi_reset reset
add_connection reset_in.out_reset ad9680_fifo.if_adc_rst reset
add_connection reset_in.out_reset ad9680_jesd204.sys_resetn reset
add_connection reset_in.out_reset avl_adxcfg_0.rcfg_reset_n reset
add_connection reset_in.out_reset avl_adxcfg_1.rcfg_reset_n reset
add_connection reset_in.out_reset avl_adxcfg_2.rcfg_reset_n reset
add_connection reset_in.out_reset avl_adxcfg_3.rcfg_reset_n reset
add_connection reset_in.out_reset bridge_0.s0_reset reset
add_connection reset_in.out_reset bridge_1.s0_reset reset
add_connection reset_in.out_reset bridge_2.m0_reset reset
add_connection reset_in.out_reset bridge_2.s0_reset reset
add_connection reset_in.out_reset bridge_3.m0_reset reset
add_connection reset_in.out_reset bridge_3.s0_reset reset
add_connection reset_in.out_reset ddr3.global_reset_n reset
add_connection reset_in.out_reset gpio.reset reset
add_connection reset_in.out_reset i2c.reset_sink reset
add_connection reset_in.out_reset jtag_uart_0.reset reset
add_connection reset_in.out_reset mcu_subsystem_cpu_0.reset reset
add_connection reset_in.out_reset mcu_subsystem_ram_0.reset1 reset
add_connection reset_in.out_reset phy_interlaken_0.reset reset
add_connection reset_in.out_reset phy_interlaken_1.reset reset
add_connection reset_in.out_reset qspi_controller2_0.reset reset
add_connection reset_in.out_reset spi.reset reset
add_connection reset_in.out_reset timer_0.reset reset
add_connection reset_in.out_reset timer_1.reset reset
add_connection ad9144_dma.m_src_axi bridge_0.s0 avalon
set_connection_parameter_value ad9144_dma.m_src_axi/bridge_0.s0 baseAddress 0x0000
add_connection ad9680_dma.m_dest_axi bridge_0.s0 avalon
set_connection_parameter_value ad9680_dma.m_dest_axi/bridge_0.s0 baseAddress 0x0000
add_connection avl_adxcfg_0.rcfg_m0 ad9144_jesd204.phy_reconfig_0 avalon
set_connection_parameter_value avl_adxcfg_0.rcfg_m0/ad9144_jesd204.phy_reconfig_0 baseAddress 0x0000
add_connection avl_adxcfg_0.rcfg_m1 ad9680_jesd204.phy_reconfig_0 avalon
set_connection_parameter_value avl_adxcfg_0.rcfg_m1/ad9680_jesd204.phy_reconfig_0 baseAddress 0x0000
add_connection avl_adxcfg_1.rcfg_m0 ad9144_jesd204.phy_reconfig_1 avalon
set_connection_parameter_value avl_adxcfg_1.rcfg_m0/ad9144_jesd204.phy_reconfig_1 baseAddress 0x0000
add_connection avl_adxcfg_1.rcfg_m1 ad9680_jesd204.phy_reconfig_1 avalon
set_connection_parameter_value avl_adxcfg_1.rcfg_m1/ad9680_jesd204.phy_reconfig_1 baseAddress 0x0000
add_connection avl_adxcfg_2.rcfg_m0 ad9144_jesd204.phy_reconfig_2 avalon
set_connection_parameter_value avl_adxcfg_2.rcfg_m0/ad9144_jesd204.phy_reconfig_2 baseAddress 0x0000
add_connection avl_adxcfg_2.rcfg_m1 ad9680_jesd204.phy_reconfig_2 avalon
set_connection_parameter_value avl_adxcfg_2.rcfg_m1/ad9680_jesd204.phy_reconfig_2 baseAddress 0x0000
add_connection avl_adxcfg_3.rcfg_m0 ad9144_jesd204.phy_reconfig_3 avalon
set_connection_parameter_value avl_adxcfg_3.rcfg_m0/ad9144_jesd204.phy_reconfig_3 baseAddress 0x0000
add_connection avl_adxcfg_3.rcfg_m1 ad9680_jesd204.phy_reconfig_3 avalon
set_connection_parameter_value avl_adxcfg_3.rcfg_m1/ad9680_jesd204.phy_reconfig_3 baseAddress 0x0000
add_connection bridge_0.m0 ddr3.ctrl_amm_0 avalon
set_connection_parameter_value bridge_0.m0/ddr3.ctrl_amm_0 baseAddress 0x0000
add_connection bridge_1.m0 ddr3.ctrl_mmr_slave_0 avalon
set_connection_parameter_value bridge_1.m0/ddr3.ctrl_mmr_slave_0 baseAddress 0x0000
add_connection bridge_2.m0 qspi_controller2_0.avl_csr avalon
set_connection_parameter_value bridge_2.m0/qspi_controller2_0.avl_csr baseAddress 0x0000
add_connection bridge_3.m0 qspi_controller2_0.avl_mem avalon
set_connection_parameter_value bridge_3.m0/qspi_controller2_0.avl_mem baseAddress 0x0000
add_connection mcu_subsystem_cpu_0.data_master ad9144_core.s_axi avalon
set_connection_parameter_value mcu_subsystem_cpu_0.data_master/ad9144_core.s_axi baseAddress 0x88050000
add_connection mcu_subsystem_cpu_0.data_master ad9144_dma.s_axi avalon
set_connection_parameter_value mcu_subsystem_cpu_0.data_master/ad9144_dma.s_axi baseAddress 0x8806b000
add_connection mcu_subsystem_cpu_0.data_master ad9144_jesd204.lane_pll_reconfig avalon
set_connection_parameter_value mcu_subsystem_cpu_0.data_master/ad9144_jesd204.lane_pll_reconfig baseAddress 0x88079000
add_connection mcu_subsystem_cpu_0.data_master ad9144_jesd204.link_management avalon
set_connection_parameter_value mcu_subsystem_cpu_0.data_master/ad9144_jesd204.link_management baseAddress 0x88078000
add_connection mcu_subsystem_cpu_0.data_master ad9144_jesd204.link_pll_reconfig avalon
set_connection_parameter_value mcu_subsystem_cpu_0.data_master/ad9144_jesd204.link_pll_reconfig baseAddress 0x88076000
add_connection mcu_subsystem_cpu_0.data_master ad9144_jesd204.link_reconfig avalon
set_connection_parameter_value mcu_subsystem_cpu_0.data_master/ad9144_jesd204.link_reconfig baseAddress 0x88064000
add_connection mcu_subsystem_cpu_0.data_master ad9680_core.s_axi avalon
set_connection_parameter_value mcu_subsystem_cpu_0.data_master/ad9680_core.s_axi baseAddress 0x88040000
add_connection mcu_subsystem_cpu_0.data_master ad9680_dma.s_axi avalon
set_connection_parameter_value mcu_subsystem_cpu_0.data_master/ad9680_dma.s_axi baseAddress 0x8806a000
add_connection mcu_subsystem_cpu_0.data_master ad9680_jesd204.link_management avalon
set_connection_parameter_value mcu_subsystem_cpu_0.data_master/ad9680_jesd204.link_management baseAddress 0x88077000
add_connection mcu_subsystem_cpu_0.data_master ad9680_jesd204.link_pll_reconfig avalon
set_connection_parameter_value mcu_subsystem_cpu_0.data_master/ad9680_jesd204.link_pll_reconfig baseAddress 0x88075000
add_connection mcu_subsystem_cpu_0.data_master ad9680_jesd204.link_reconfig avalon
set_connection_parameter_value mcu_subsystem_cpu_0.data_master/ad9680_jesd204.link_reconfig baseAddress 0x88060000
add_connection mcu_subsystem_cpu_0.data_master avl_adxcfg_0.rcfg_s0 avalon
set_connection_parameter_value mcu_subsystem_cpu_0.data_master/avl_adxcfg_0.rcfg_s0 baseAddress 0x88071000
add_connection mcu_subsystem_cpu_0.data_master avl_adxcfg_0.rcfg_s1 avalon
set_connection_parameter_value mcu_subsystem_cpu_0.data_master/avl_adxcfg_0.rcfg_s1 baseAddress 0x8806d000
add_connection mcu_subsystem_cpu_0.data_master avl_adxcfg_1.rcfg_s0 avalon
set_connection_parameter_value mcu_subsystem_cpu_0.data_master/avl_adxcfg_1.rcfg_s0 baseAddress 0x88072000
add_connection mcu_subsystem_cpu_0.data_master avl_adxcfg_1.rcfg_s1 avalon
set_connection_parameter_value mcu_subsystem_cpu_0.data_master/avl_adxcfg_1.rcfg_s1 baseAddress 0x8806e000
add_connection mcu_subsystem_cpu_0.data_master avl_adxcfg_2.rcfg_s0 avalon
set_connection_parameter_value mcu_subsystem_cpu_0.data_master/avl_adxcfg_2.rcfg_s0 baseAddress 0x88073000
add_connection mcu_subsystem_cpu_0.data_master avl_adxcfg_2.rcfg_s1 avalon
set_connection_parameter_value mcu_subsystem_cpu_0.data_master/avl_adxcfg_2.rcfg_s1 baseAddress 0x8806f000
add_connection mcu_subsystem_cpu_0.data_master avl_adxcfg_3.rcfg_s0 avalon
set_connection_parameter_value mcu_subsystem_cpu_0.data_master/avl_adxcfg_3.rcfg_s0 baseAddress 0x88074000
add_connection mcu_subsystem_cpu_0.data_master avl_adxcfg_3.rcfg_s1 avalon
set_connection_parameter_value mcu_subsystem_cpu_0.data_master/avl_adxcfg_3.rcfg_s1 baseAddress 0x88070000
add_connection mcu_subsystem_cpu_0.data_master bridge_0.s0 avalon
set_connection_parameter_value mcu_subsystem_cpu_0.data_master/bridge_0.s0 baseAddress 0x0000
add_connection mcu_subsystem_cpu_0.data_master bridge_1.s0 avalon
set_connection_parameter_value mcu_subsystem_cpu_0.data_master/bridge_1.s0 baseAddress 0x8806c000
add_connection mcu_subsystem_cpu_0.data_master bridge_2.s0 avalon
set_connection_parameter_value mcu_subsystem_cpu_0.data_master/bridge_2.s0 baseAddress 0x8807b800
add_connection mcu_subsystem_cpu_0.data_master bridge_3.s0 avalon
set_connection_parameter_value mcu_subsystem_cpu_0.data_master/bridge_3.s0 baseAddress 0x80000000
add_connection mcu_subsystem_cpu_0.data_master gpio.s1 avalon
set_connection_parameter_value mcu_subsystem_cpu_0.data_master/gpio.s1 baseAddress 0x8807b8a0
add_connection mcu_subsystem_cpu_0.data_master i2c.csr avalon
set_connection_parameter_value mcu_subsystem_cpu_0.data_master/i2c.csr baseAddress 0x8807b840
add_connection mcu_subsystem_cpu_0.data_master jtag_uart_0.avalon_jtag_slave avalon
set_connection_parameter_value mcu_subsystem_cpu_0.data_master/jtag_uart_0.avalon_jtag_slave baseAddress 0x8807b900
add_connection mcu_subsystem_cpu_0.data_master mcu_subsystem_cpu_0.debug_mem_slave avalon
set_connection_parameter_value mcu_subsystem_cpu_0.data_master/mcu_subsystem_cpu_0.debug_mem_slave baseAddress 0x8807a800
add_connection mcu_subsystem_cpu_0.data_master mcu_subsystem_ram_0.s1 avalon
set_connection_parameter_value mcu_subsystem_cpu_0.data_master/mcu_subsystem_ram_0.s1 baseAddress 0x88020000
add_connection mcu_subsystem_cpu_0.data_master phy_interlaken_0.phy_data_ctrl_csr_s0 avalon
set_connection_parameter_value mcu_subsystem_cpu_0.data_master/phy_interlaken_0.phy_data_ctrl_csr_s0 baseAddress 0x8807b400
add_connection mcu_subsystem_cpu_0.data_master phy_interlaken_0.serial_clock_reconfig_s0 avalon
set_connection_parameter_value mcu_subsystem_cpu_0.data_master/phy_interlaken_0.serial_clock_reconfig_s0 baseAddress 0x88069000
add_connection mcu_subsystem_cpu_0.data_master phy_interlaken_1.phy_data_ctrl_csr_s0 avalon
set_connection_parameter_value mcu_subsystem_cpu_0.data_master/phy_interlaken_1.phy_data_ctrl_csr_s0 baseAddress 0x8807b000
add_connection mcu_subsystem_cpu_0.data_master phy_interlaken_1.serial_clock_reconfig_s0 avalon
